# Altium schematic sheet 01_POWER.SchDoc
size 566 x 498 mm
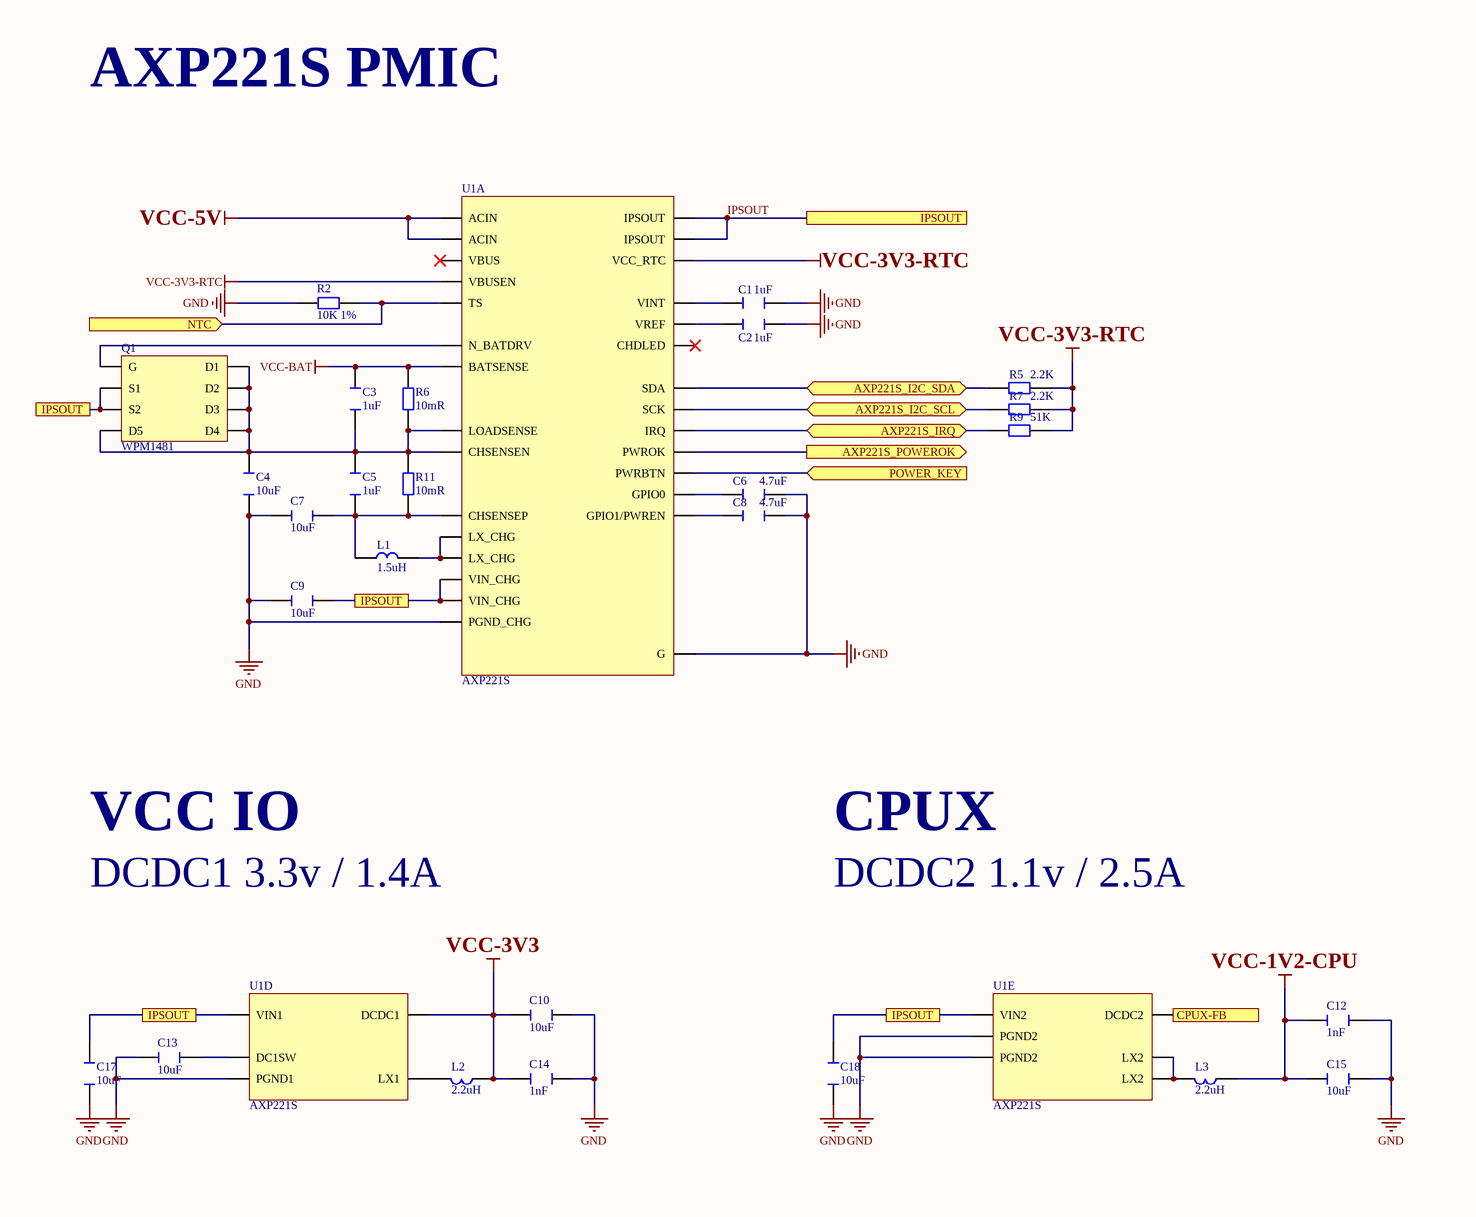
[diagram p0: 01_POWER.SchDoc, top left]
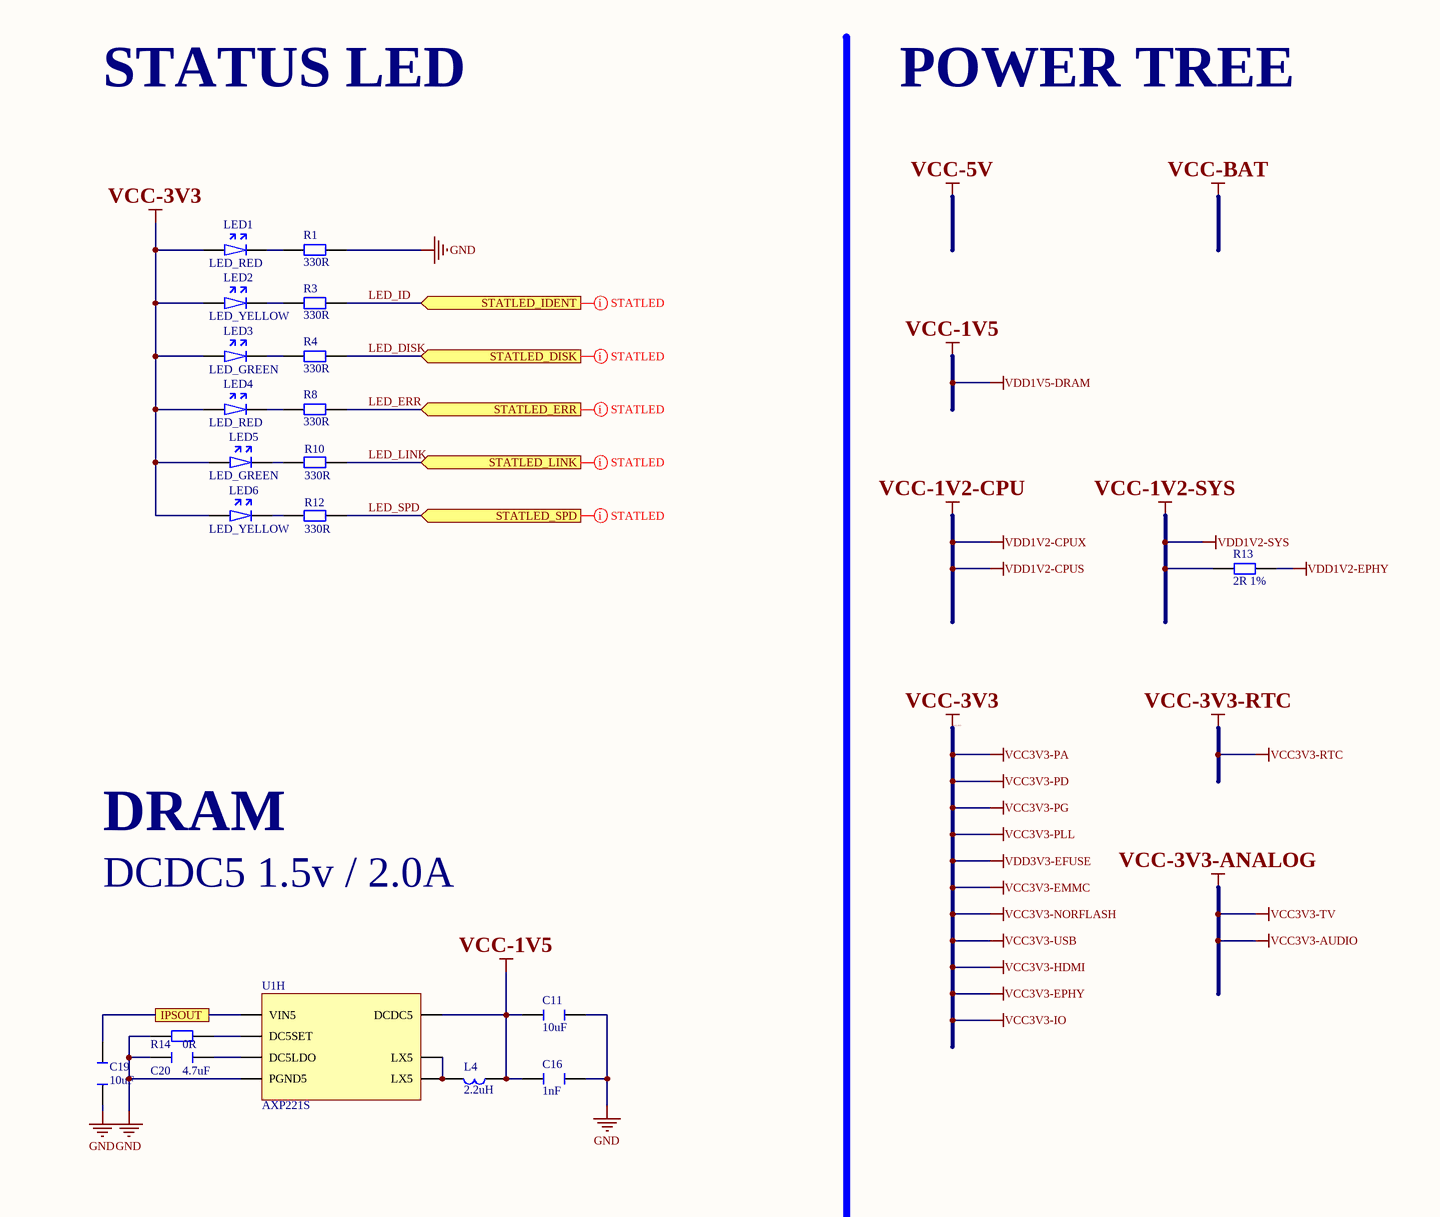
[diagram p1: 01_POWER.SchDoc, top right]
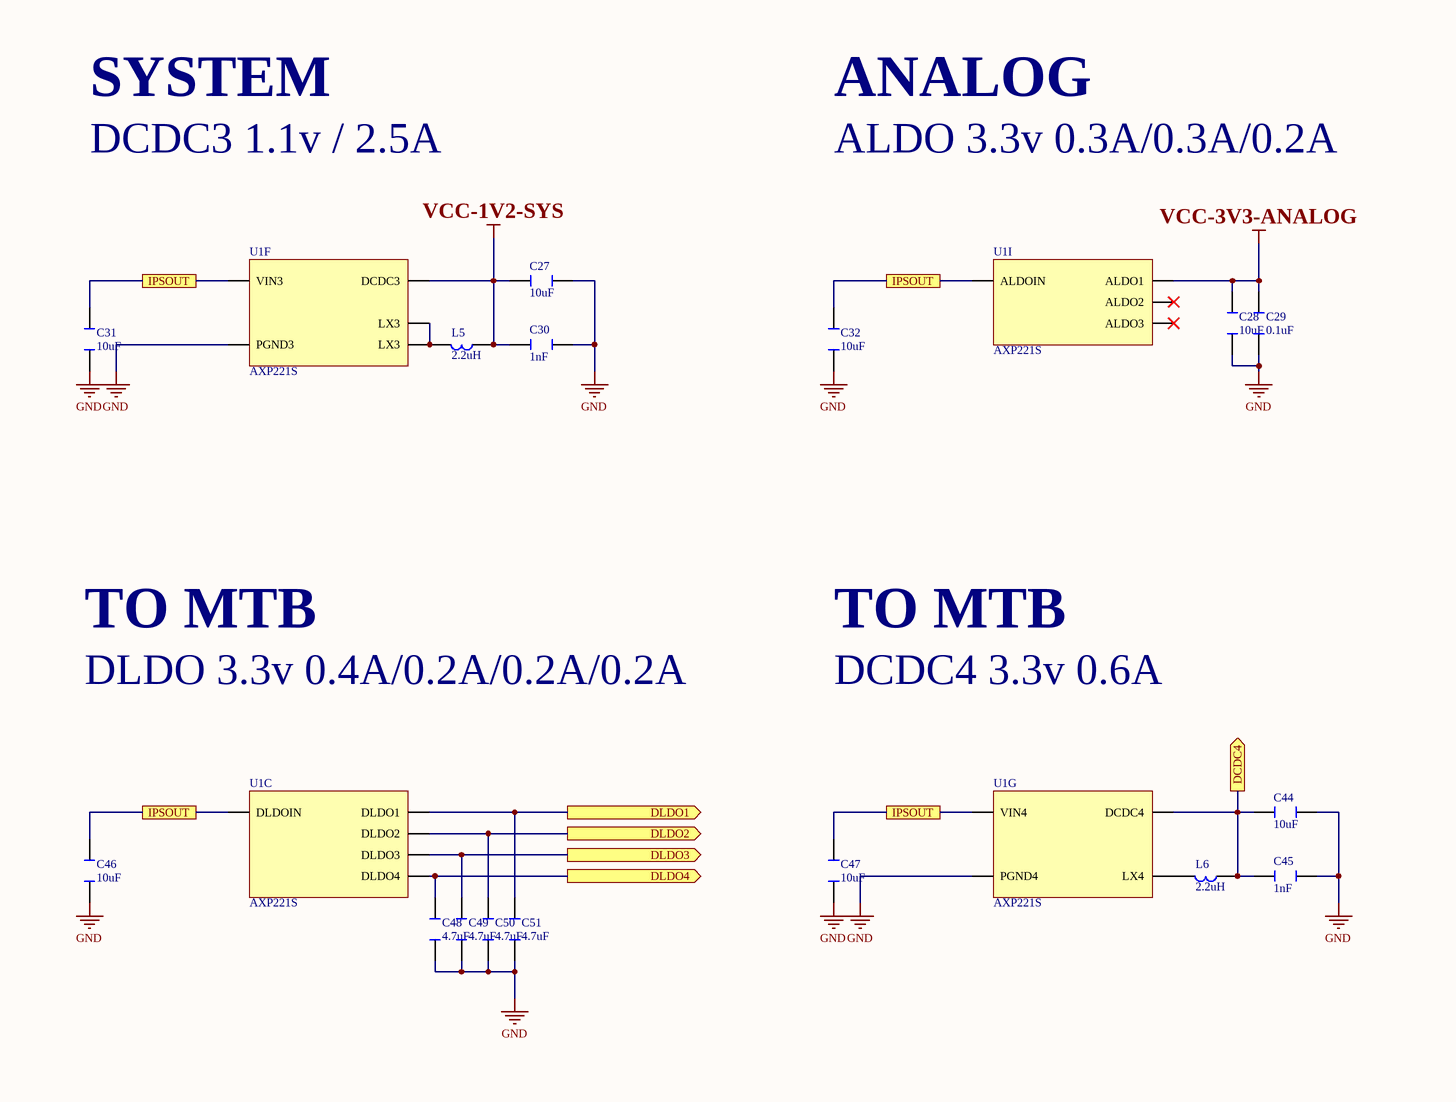
[diagram p2: 01_POWER.SchDoc, bottom left]
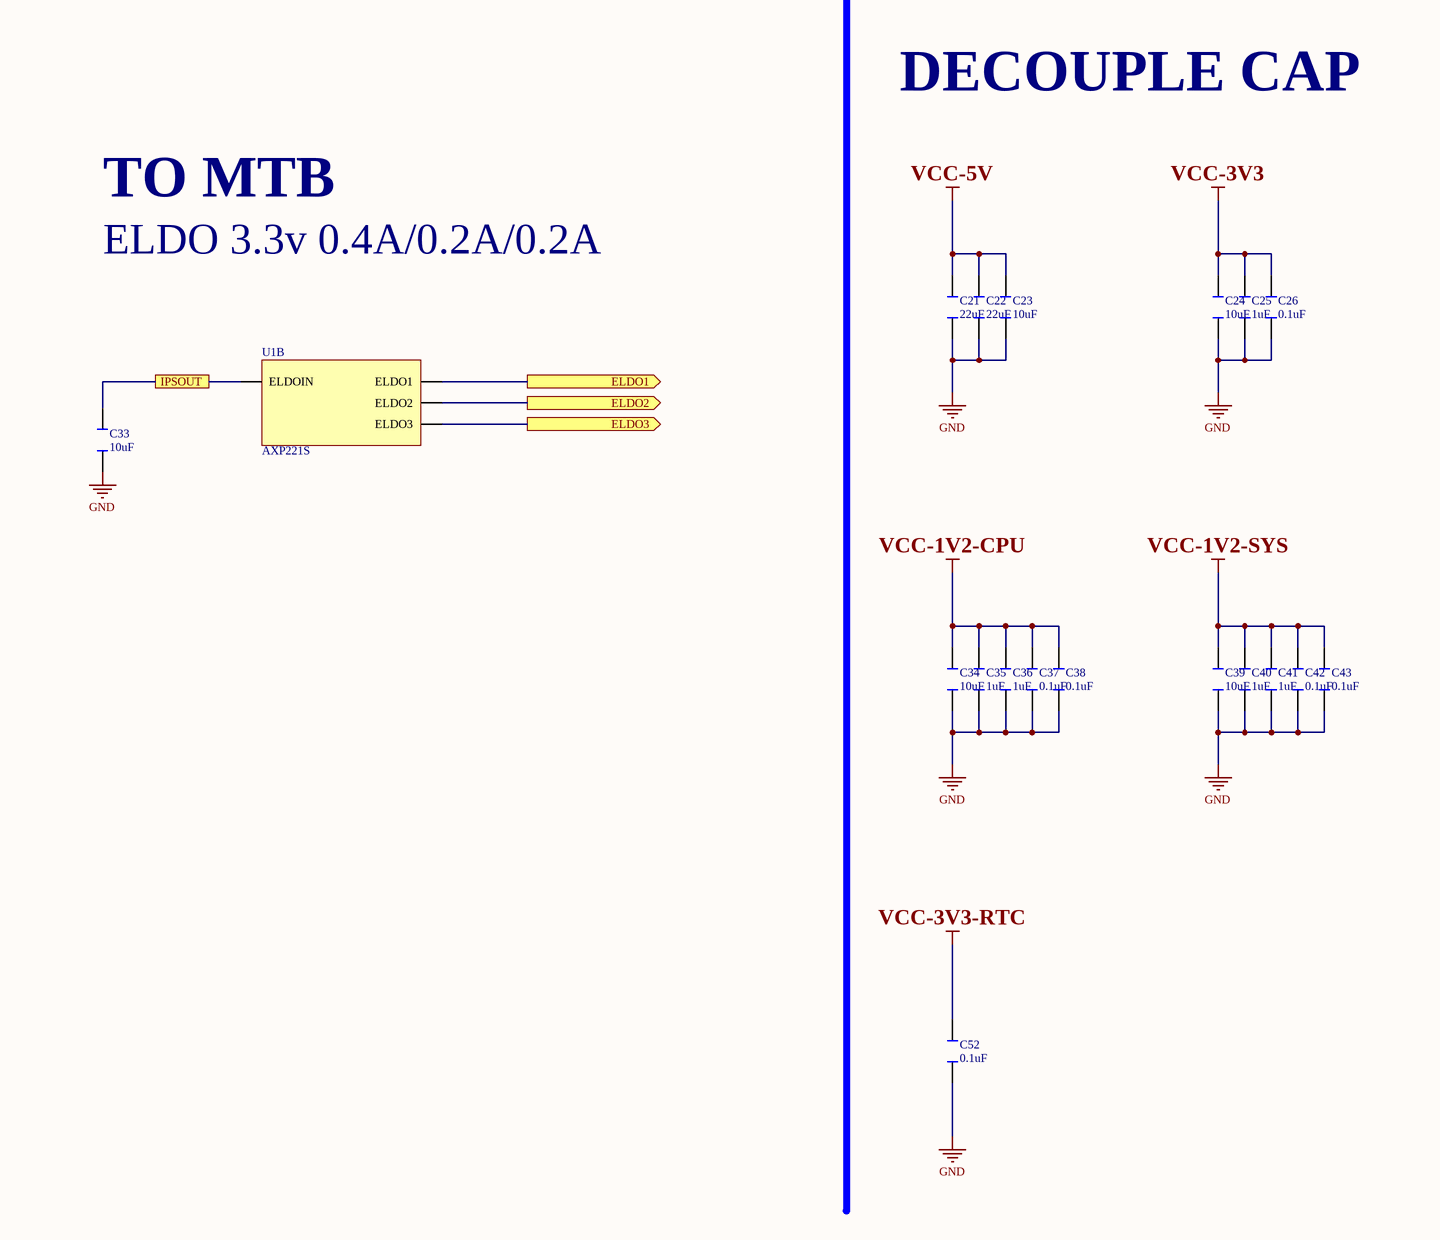
[diagram p3: 01_POWER.SchDoc, bottom right]

## Parts
C1  1uF  [C0603]
C2  1uF  [C0603]
C3  1uF  [C0603]
C4  10uF  [C0603]
C5  1uF  [C0603]
C6  4.7uF  [C0402]
C7  10uF  [C0603]
C8  4.7uF  [C0402]
C9  10uF  [C0603]
C10  10uF  [C0603]
C11  10uF  [C0603]
C12  1nF  [C0603]
C13  10uF  [C0603]
C14  1nF  [C0603]
C15  10uF  [C0603]
C16  1nF  [C0603]
C17  10uF  [C0603]
C18  10uF  [C0603]
C19  10uF  [C0603]
C20  4.7uF  [C0603]
C21  22uF  [C0603]
C22  22uF  [C0603]
C23  10uF  [C0603]
C24  10uF  [C0603]
C25  1uF  [C0402]
C26  0.1uF  [C0603]
C27  10uF  [C0603]
C28  10uF  [C0603]
C29  0.1uF  [C0603]
C30  1nF  [C0603]
C31  10uF  [C0603]
C32  10uF  [C0603]
C33  10uF  [C0603]
C34  10uF  [C0603]
C35  1uF  [C0603]
C36  1uF  [C0603]
C37  0.1uF  [C0402]
C38  0.1uF  [C0402]
C39  10uF  [C0603]
C40  1uF  [C0402]
C41  1uF  [C0603]
C42  0.1uF  [C0402]
C43  0.1uF  [C0402]
C44  10uF  [C0603]
C45  1nF  [C0603]
C46  10uF  [C0603]
C47  10uF  [C0603]
C48  4.7uF  [C0603]
C49  4.7uF  [C0603]
C50  4.7uF  [C0603]
C51  4.7uF  [C0603]
C52  0.1uF  [C0402]
L1  1.5uH  [L2520]
L2  2.2uH  [L2520]
L3  2.2uH  [L2520]
L4  2.2uH  [L2520]
L5  2.2uH  [L2520]
L6  2.2uH  [L2520]
LED1  LED_RED  [LED0603_RED]
LED2  LED_YELLOW  [LED0603_YELLOW]
LED3  LED_GREEN  [LED0603_GREEN]
LED4  LED_RED  [LED0603_RED]
LED5  LED_GREEN  [LED0603_GREEN]
LED6  LED_YELLOW  [LED0603_YELLOW]
Q1  WPM1481  [WPM1481]
R1  330R  [R0402]
R2  10K 1%  [R0402]
R3  330R  [R0402]
R4  330R  [R0402]
R5  2.2K  [R0402]
R6  10mR  [R0805]
R7  2.2K  [R0402]
R8  330R  [R0402]
R9  51K  [R0402]
R10  330R  [R0402]
R11  10mR  [R0805]
R12  330R  [R0402]
R13  2R 1%  [R0402]
R14  0R  [R0402]
U1  AXP221S  [AXP221S]  (parts A,B,C,D,E,F,G,H,I of 9)

## Ports
AXP221S_I2C_SCL (bidir), AXP221S_I2C_SDA (bidir), AXP221S_IRQ (bidir), AXP221S_POWEROK (out), CPUX-FB (out), DCDC4 (out), DLDO1 (out), DLDO2 (out), DLDO3 (out), DLDO4 (out), ELDO1 (out), ELDO2 (out), ELDO3 (out), IPSOUT, NTC (in), POWER_KEY (in), STATLED_DISK (in), STATLED_ERR (in), STATLED_IDENT (in), STATLED_LINK (in), STATLED_SPD (in)

## Nets
GND: C1.2 C2.2 C4.1 C6.2 C7.1 C8.2 C9.1 C10.2 C11.2 C12.2 C13.1 C14.1 C15.2 C16.2 C17.2 C18.2 C19.2 C20.2 C21.1 C22.1 C23.1 C24.1 C25.1 C26.1 C27.2 C28.2 C29.1 C30.2 C31.2 C32.2 C33.2 C34.1 C35.1 C36.1 C37.1 C38.1 C39.1 C40.1 C41.1 C42.1 C43.1 C44.2 C45.2 C46.2 C47.2 C48.1 C49.1 C50.1 C51.1 C52.1 R1.2 R2.1 R14.1 U1.6(PGND5) U1.15(PGND1) U1.26(PGND2) U1.27(PGND2) U1.42(PGND3) U1.59(PGND_CHG) U1.66(PGND4) U1.69(G)
VCC-1V2-CPU: C12.1 C15.1 C34.2 C35.2 C36.2 C37.2 C38.2 L3.1  [also labelled VDD1V2-CPUS, VDD1V2-CPUX]
VCC-1V2-SYS: C27.1 C30.1 C39.2 C40.2 C41.2 C42.2 C43.2 L5.1 R13.1 U1.38(DCDC3)  [also labelled VDD1V2-SYS]
VCC-1V5: C11.1 C16.1 L4.1 U1.5(DCDC5)  [also labelled VDD1V5-DRAM]
VCC-3V3: C10.1 C14.2 C24.2 C25.2 C26.2 L2.1 LED1.1 LED2.1 LED3.1 LED4.1 LED5.1 LED6.1 U1.21(DCDC1)  [also labelled VCC3V3-EMMC, VCC3V3-EPHY, VCC3V3-HDMI, VCC3V3-IO, VCC3V3-NORFLASH, VCC3V3-PA, VCC3V3-PD, VCC3V3-PG, VCC3V3-PLL, VCC3V3-USB, VDD3V3-EFUSE]
VCC-3V3-ANALOG: C28.1 C29.2 U1.32(ALDO1)  [also labelled VCC3V3-AUDIO, VCC3V3-TV]
VCC-3V3-RTC: C52.2 R5.2 R7.2 R9.2 U1.11(VBUSEN) U1.46(VCC_RTC)  [also labelled VCC3V3-RTC]
VCC-5V: C21.2 C22.2 C23.2 U1.55(ACIN) U1.56(ACIN)
VCC-BAT: C3.2 R6.2 U1.49(BATSENSE)
VDD1V2-EPHY: R13.2
AXP221S_I2C_SCL: R7.1 U1.44(SCK) ; port AXP221S_I2C_SCL
AXP221S_I2C_SDA: R5.1 U1.45(SDA) ; port AXP221S_I2C_SDA
AXP221S_IRQ: R9.1 U1.29(IRQ) ; port AXP221S_IRQ
AXP221S_POWEROK: U1.43(PWROK) ; port AXP221S_POWEROK
CPUX-FB: U1.28(DCDC2) ; port CPUX-FB
DCDC4: C44.1 C45.1 L6.1 U1.67(DCDC4) ; port DCDC4
DLDO1: C51.2 U1.19(DLDO1) ; port DLDO1
DLDO2: C50.2 U1.17(DLDO2) ; port DLDO2
DLDO3: C49.2 U1.16(DLDO3) ; port DLDO3
DLDO4: C48.2 U1.20(DLDO4) ; port DLDO4
ELDO1: U1.68(ELDO1) ; port ELDO1
ELDO2: U1.2(ELDO2) ; port ELDO2
ELDO3: U1.3(ELDO3) ; port ELDO3
IPSOUT: C9.2 C17.1 C18.1 C19.1 C31.1 C32.1 C33.1 C46.1 C47.1 Q1.4(S1) Q1.7(S2) U1.1(ELDOIN) U1.9(VIN5) U1.13(VIN1) U1.18(DLDOIN) U1.23(VIN2) U1.33(ALDOIN) U1.39(VIN3) U1.53(IPSOUT) U1.54(IPSOUT) U1.62(VIN_CHG) U1.63(VIN_CHG) U1.64(VIN4) ; port IPSOUT
LED_DISK: R4.2 ; port STATLED_DISK
LED_ERR: R8.2 ; port STATLED_ERR
LED_ID: R3.2 ; port STATLED_IDENT
LED_LINK: R10.1 ; port STATLED_LINK
LED_SPD: R12.1 ; port STATLED_SPD
NTC: R2.2 U1.30(TS) ; port NTC
POWER_KEY: U1.12(PWRBTN) ; port POWER_KEY
NetC1_1: C1.1 U1.47(VINT)
NetC2_1: C2.1 U1.35(VREF)
NetC3_1: C3.1 C4.2 C5.2 Q1.1(D1) Q1.2(D2) Q1.5(D3) Q1.6(D4) Q1.8(D5) R6.1 R11.2 U1.50(LOADSENSE) U1.58(CHSENSEN)
NetC5_1: C5.1 C7.2 L1.1 R11.1 U1.57(CHSENSEP)
NetC6_1: C6.1 U1.37(GPIO0)
NetC8_1: C8.1 U1.31(GPIO1/PWREN)
NetC13_2: C13.2 U1.22(DC1SW)
NetC20_1: C20.1 U1.4(DC5LDO)
NetL1_2: L1.2 U1.60(LX_CHG) U1.61(LX_CHG)
NetL2_2: L2.2 U1.14(LX1)
NetL3_2: L3.2 U1.24(LX2) U1.25(LX2)
NetL4_2: L4.2 U1.7(LX5) U1.8(LX5)
NetL5_2: L5.2 U1.40(LX3) U1.41(LX3)
NetL6_2: L6.2 U1.65(LX4)
NetLED1_2: LED1.2 R1.1
NetLED2_2: LED2.2 R3.1
NetLED3_2: LED3.2 R4.1
NetLED4_2: LED4.2 R8.1
NetLED5_2: LED5.2 R10.2
NetLED6_2: LED6.2 R12.2
NetQ1_3: Q1.3(G) U1.51(N_BATDRV)
NetR14_2: R14.2 U1.10(DC5SET)

Not connected (* = marked no-connect by the designer): U1 34(ALDO2)* 36(ALDO3)* 48(VBUS)* 52(CHDLED)*

## Layout directives
net class STATLED: LED_DISK, LED_ERR, LED_ID, LED_LINK, LED_SPD

## Notes on the sheet
- AXP221S PMIC
- STATUS LED
- POWER TREE
- VCC IO
- CPUX
- DRAM
- DCDC1 3.3v / 1.4A
- DCDC2 1.1v / 2.5A
- DCDC5 1.5v / 2.0A
- DECOUPLE CAP
- SYSTEM
- ANALOG
- TO MTB
- DCDC3 1.1v / 2.5A
- ALDO 3.3v 0.3A/0.3A/0.2A
- ELDO 3.3v 0.4A/0.2A/0.2A
- DLDO 3.3v 0.4A/0.2A/0.2A/0.2A
- DCDC4 3.3v 0.6A

## Library data of the parts
C1-C3 C5 C25 C35 C36 C40 C41 = C_1UF
C4 C7 C9-C11 C13 C15 C17-C19 C23 C24 C27 C28 C31-C34 C39 C44 C46 C47 = C_10UF
C6 C8 C20 C48-C51 = C_4.7UF
C12 C14 C16 C30 C45 = C_1NF
C21 C22 = C_22UF
C26 C29 C37 C38 C42 C43 C52 = C_0.1UF
L1 = L_1.5UH
L2-L6 = L_2.2UH
R1 R3 R4 R8 R10 R12 = R_330R
R2 = R_10K_P1
R5 R7 = R_2.2K
R6 R11 = R_10mR
R9 = R_51K
R13 = R_2R_P1
R14 = R_0R